# EAGLE board SwitchBoard (EAGLE 7.2.0), part 1 of 2
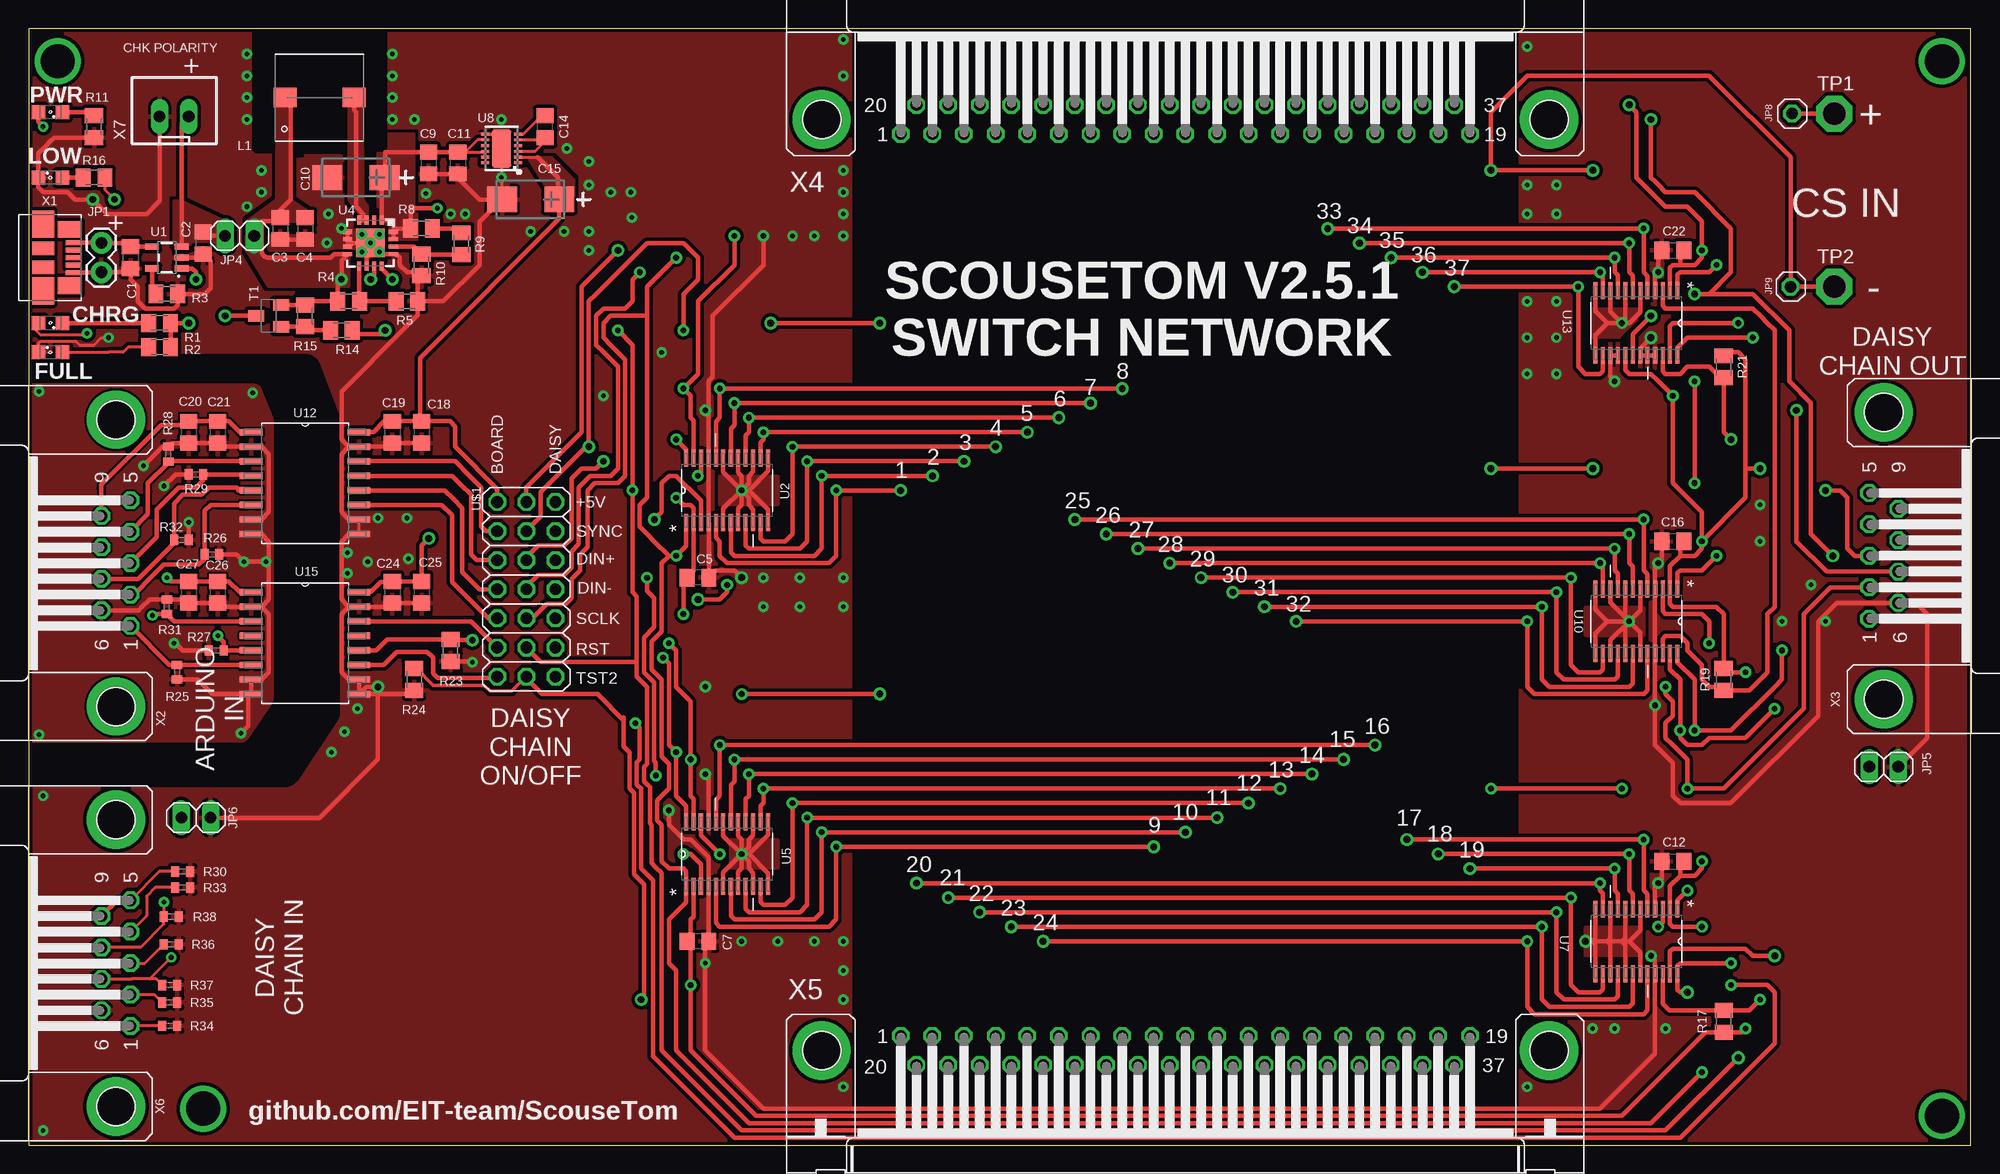
[diagram p6: board, top side]
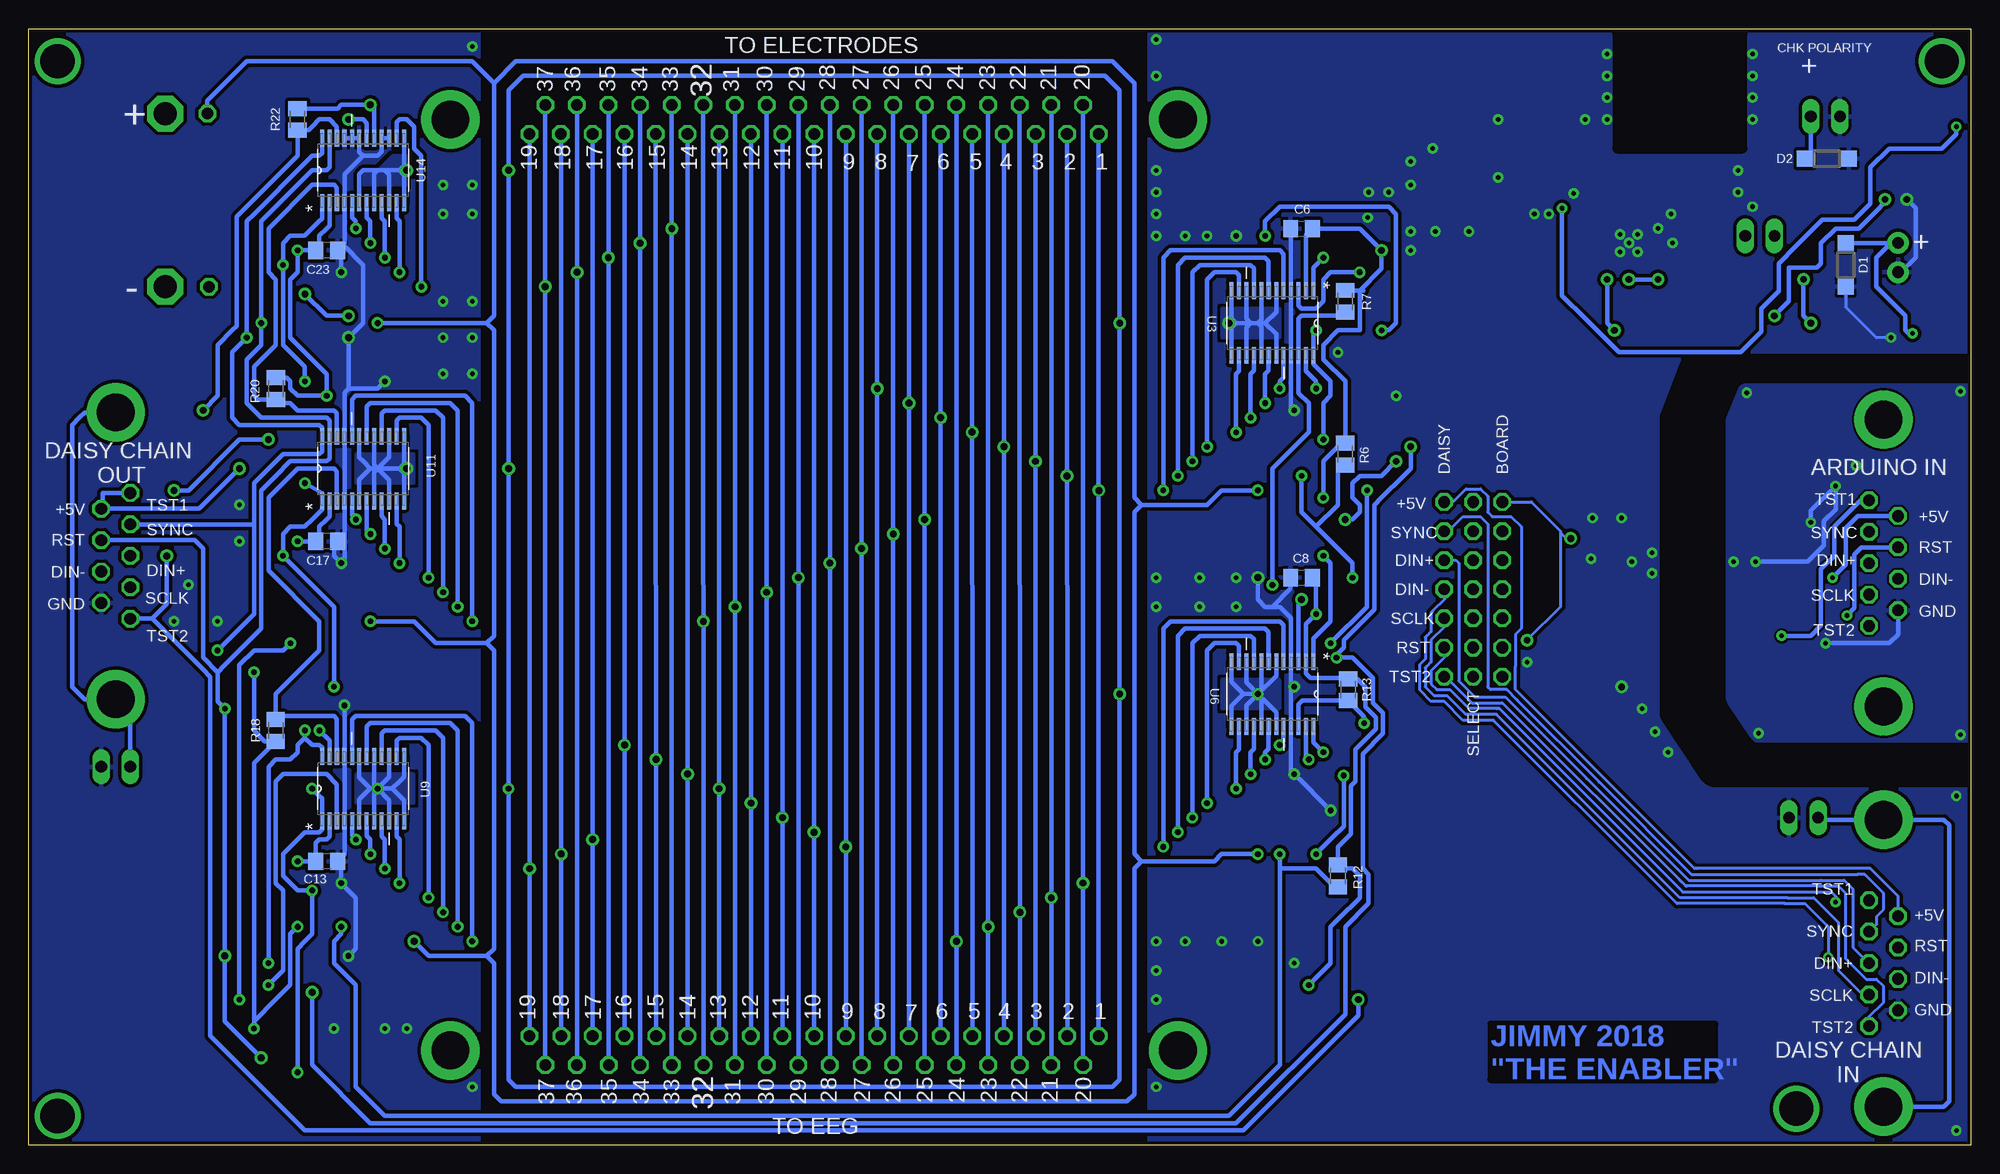
[diagram p7: board, bottom side, seen from below]

Size 169.53 x 97.46 mm. Coordinates in mm from the lower left corner, seen from the top.
Outline: 0,0 169.53,0 169.53,97.46 0,97.46 0,0
Copper layers (1*16): Top 0.035mm / dielectric 1.5mm / Bottom 0.035mm
Design rules "pcbtrain": minimum track width 0.2mm, minimum drill 0.4mm, track to track 0.2mm, track to pad 0.2mm, pad to pad 0.2mm, via to via 0.2mm, smd to smd 0mil, copper to edge 10mil, drill to drill 0.2mm, minimum pad ring 10mil, minimum via ring 10mil, stop-mask expansion 0.125mm, vias tented up to drill 0mil, thermal gap 10mil
tRestrict: area 19.9,86.6 to 30.9,97; area -5.1,31.8 to 26.7,68.6; area 72.4,-1.3 to 129.5,100.3
bRestrict: area 19.9,87 to 30.9,97; area -5.1,31.8 to 26.7,68.6; area 72.4,-1.3 to 129.5,100.3

## Footprints (pad centres in the part's own frame; a part is rotated, then mirrored left to right if it is on the bottom)
C0805 = smd 1.3 x 1.5: 1 -0.95,0; 2 0.95,0
CT6032 = smd 2.6 x 2.2: + -2.5,0; - 2.5,0
SOD123 = smd 1.4 x 1.4: A 1.9,0; C -1.9,0
1X02 = drill 1.016 pad 1.88: 1 0,0; 2 2.54,0
1X02' = drill 1.016 long: 1 -1.27,0; 2 1.27,0
1X01 = drill 1.016 octagon: 1 0,0
WE-PD_7332/7345_PLASTIC_BASE = smd 1.7 x 2: 1 0,3; 2 0,-3
SML0805 = smd 1.2 x 1.2: A 1.05,0; C -1.05,0
M0805 = smd 1.3 x 1.6: 1 -0.95,0; 2 0.95,0
R0402 = smd 0.7 x 0.9: 1 -0.65,0; 2 0.65,0
SOT23-BEC = smd 1 x 1.4: B -0.95,-1.1; C 0,1.1; E 0.95,-1.1
P1-20 = drill 2.007 pad 3.15 octagon: TP 0,0
SOT23-5 = smd 0.55 x 1.2: 1 -0.95,-1.3; 2 0,-1.3; 3 0.95,-1.3; 4 0.95,1.3; 5 -0.95,1.3
SOP65P640X120-24N = smd 1.473 x 0.356: 1 -2.819,3.581; 2 -2.819,2.921; 3 -2.819,2.286; 4 -2.819,1.626; 5 -2.819,0.965; 6 -2.819,0.33; 7 -2.819,-0.33; 8 -2.819,-0.965; 9 -2.819,-1.626; 10 -2.819,-2.286; 11 -2.819,-2.921; 12 -2.819,-3.581; 13 2.819,-3.581; 14 2.819,-2.921; 15 2.819,-2.286; 16 2.819,-1.626; 17 2.819,-0.965; 18 2.819,-0.33; 19 2.819,0.33; 20 2.819,0.965; 21 2.819,1.626; 22 2.819,2.286; 23 2.819,2.921; 24 2.819,3.581
QFN16-4X4 = smd 0.8 x 0.35: 1 -2,0.975; 2 -2,0.325; 3 -2,-0.325; 4 -2,-0.975; 9 2,-0.975; 10 2,-0.325; 11 2,0.325; 12 2,0.975 | smd 0.35 x 0.8: 5 -0.975,-2; 6 -0.325,-2; 7 0.325,-2; 8 0.975,-2; 13 0.975,2; 14 0.325,2; 15 -0.325,2; 16 -0.975,2 | smd 2.5 x 2.5: EXP 0,0
DFN12 = smd 0.25 x 0.7: 1 -1.25,-1.45; 2 -0.75,-1.45; 3 -0.25,-1.45; 4 0.25,-1.45; 5 0.75,-1.45; 6 1.25,-1.45; 7 1.25,1.45; 8 0.75,1.45; 9 0.25,1.45; 10 -0.25,1.45; 11 -0.75,1.45; 12 -1.25,1.45 | smd 3.3 x 1.7: EXP 0,0
SOIC127P1032X265-16N = smd 1.981 x 0.559: 1 -4.699,4.445; 2 -4.699,3.175; 3 -4.699,1.905; 4 -4.699,0.635; 5 -4.699,-0.635; 6 -4.699,-1.905; 7 -4.699,-3.175; 8 -4.699,-4.445; 9 4.699,-4.445; 10 4.699,-3.175; 11 4.699,-1.905; 12 4.699,-0.635; 13 4.699,0.635; 14 4.699,1.905; 15 4.699,3.175; 16 4.699,4.445
3X07 = drill 1.016 octagon: 1 -7.62,-3.81; 2 -7.62,1.27; 3 -5.08,-3.81; 4 -5.08,1.27; 5 -2.54,-3.81; 6 -2.54,1.27; 7 0,-3.81; 8 0,1.27; 9 2.54,-3.81; 10 2.54,1.27; 11 5.08,-3.81; 12 5.08,1.27; 13 7.62,-3.81; 14 7.62,1.27; 15 -7.62,-1.27; 16 -5.08,-1.27; 17 -2.54,-1.27; 18 0,-1.27; 19 2.54,-1.27; 20 5.08,-1.27; 21 7.62,-1.27
MOLEX_47346-0001 = smd 0.45 x 1.38: 1 -1.3,0; 2 -0.65,0; 3 0,0; 4 0.65,0; 5 1.3,0 | smd 1.475 x 2.1: M1 -2.462,-0.36; M2 2.462,-0.36 | smd 2.375 x 1.9: M3 -2.913,-2.66; M6 2.913,-2.66 | smd 1.175 x 1.9: M4 -0.82,-2.66; M5 0.85,-2.66
F09HP = drill 1.016 octagon: 1 -5.486,-1.27; 2 -2.743,-1.27; 3 0,-1.27; 4 2.743,-1.27; 5 5.486,-1.27; 6 -4.115,1.27; 7 -1.372,1.27; 8 1.372,1.27; 9 4.115,1.27 | drill 3.302 pad 5.08: G1 -12.522,0; G2 12.522,0
M09HP = drill 1.016 octagon: 1 -5.486,1.27; 2 -2.743,1.27; 3 0,1.27; 4 2.743,1.27; 5 5.486,1.27; 6 -4.115,-1.27; 7 -1.372,-1.27; 8 1.372,-1.27; 9 4.115,-1.27 | drill 3.302 pad 5.08: G1 -12.522,0; G2 12.522,0
F37HP = drill 1.016 octagon: 1 -24.841,-1.27; 2 -22.073,-1.27; 3 -19.329,-1.27; 4 -16.561,-1.27; 5 -13.792,-1.27; 6 -11.049,-1.27; 7 -8.28,-1.27; 8 -5.512,-1.27; 9 -2.769,-1.27; 10 0,-1.27; 11 2.769,-1.27; 12 5.512,-1.27; 13 8.28,-1.27; 14 11.049,-1.27; 15 13.818,-1.27; 16 16.561,-1.27; 17 19.329,-1.27; 18 22.098,-1.27; 19 24.841,-1.27; 20 -23.47,1.27; 21 -20.701,1.27; 22 -17.932,1.27; 23 -15.189,1.27; 24 -12.421,1.27; 25 -9.652,1.27; 26 -6.909,1.27; 27 -4.14,1.27; 28 -1.372,1.27; 29 1.372,1.27; 30 4.14,1.27; 31 6.909,1.27; 32 9.677,1.27; 33 12.421,1.27; 34 15.189,1.27; 35 17.958,1.27; 36 20.701,1.27; 37 23.47,1.27 | drill 3.302 pad 5.08: G1 -31.75,0; G2 31.75,0
M37HP = drill 1.016 octagon: 1 -24.841,1.27; 2 -22.098,1.27; 3 -19.329,1.27; 4 -16.561,1.27; 5 -13.818,1.27; 6 -11.049,1.27; 7 -8.28,1.27; 8 -5.512,1.27; 9 -2.769,1.27; 10 0,1.27; 11 2.769,1.27; 12 5.512,1.27; 13 8.28,1.27; 14 11.049,1.27; 15 13.792,1.27; 16 16.561,1.27; 17 19.329,1.27; 18 22.073,1.27; 19 24.841,1.27; 20 -23.47,-1.27; 21 -20.701,-1.27; 22 -17.958,-1.27; 23 -15.189,-1.27; 24 -12.421,-1.27; 25 -9.652,-1.27; 26 -6.909,-1.27; 27 -4.14,-1.27; 28 -1.372,-1.27; 29 1.372,-1.27; 30 4.14,-1.27; 31 6.909,-1.27; 32 9.652,-1.27; 33 12.421,-1.27; 34 15.189,-1.27; 35 17.932,-1.27; 36 20.701,-1.27; 37 23.47,-1.27 | drill 3.302 pad 5.08: G1 -31.75,0; G2 31.75,0
JST-XH-02-PACKAGE-LONG-PAD = drill 1.016 long: 1 -1.27,0; 2 1.27,0

## Placement (x,y rotation side)
C1  10uF  [C0805]  8.89,77.47 270 top
C2  10uF  [C0805]  15.24,78.74 270 top
C3  10uF  [C0805]  21.97,80.01 270 top
C4  0.1uF  [C0805]  24.13,80.01 270 top
C5  0.1uF  [C0805]  58.42,49.53 180 top
C6  0.1uF  [C0805]  58.42,80.01 0 bottom
C7  0.1uF  [C0805]  58.42,17.78 180 top
C8  0.1uF  [C0805]  58.42,49.53 0 bottom
C9  2.2uF  [C0805]  34.92,85.72 270 top
C10  100uF  [CT6032]  28.57,84.46 180 top
C11  10uF  [C0805]  37.47,85.72 270 top
C12  0.1uF  [C0805]  143.51,24.76 0 top
C13  0.1uF  [C0805]  143.51,24.77 180 bottom
C14  0.01uF  [C0805]  45.09,88.9 90 top
C15  100uF  [CT6032]  43.81,82.55 180 top
C16  0.1uF  [C0805]  143.51,52.7 0 top
C17  0.1uF  [C0805]  143.51,52.71 180 bottom
C18  .1uF  [C0805]  34.29,62.23 270 top
C19  1uF  [C0805]  31.75,62.23 270 top
C20  .1uF  [C0805]  13.97,62.23 270 top
C21  1uF  [C0805]  16.51,62.23 270 top
C22  0.1uF  [C0805]  143.51,78.1 0 top
C23  0.1uF  [C0805]  143.51,78.11 180 bottom
C24  .1uF  [C0805]  31.75,48.26 270 top
C25  1uF  [C0805]  34.29,48.26 270 top
C26  .1uF  [C0805]  16.51,48.26 270 top
C27  1uF  [C0805]  13.97,48.26 270 top
D1  1N4148W-7-F  [SOD123]  10.92,76.84 270 bottom
D2  1N4148W-7-F  [SOD123]  12.57,86.11 0 bottom
JP1  IN  [1X02]  6.35,78.74 270 top
JP4  PWR  [1X02']  18.41,79.38 0 top
JP5  Shld  [1X02']  161.93,33.02 180 top
JP6  Shld  [1X02']  14.61,28.57 0 top
JP8  CS_IN+  [1X01]  153.92,90.04 0 top
JP9  CS_IN-  [1X01]  153.8,74.93 0 top
L1  6.8uH  [WE-PD_7332/7345_PLASTIC_BASE]  25.4,91.44 90 top
LED1  YELLOW  [SML0805]  1.9,71.75 180 top
LED2  GREEN  [SML0805]  1.9,69.22 0 top
LED3  GREEN  [SML0805]  1.9,90.17 180 top
LED4  RED  [SML0805]  1.9,84.46 0 top
R1  470  [M0805]  11.43,71.75 180 top
R2  1k  [M0805]  11.43,69.66 180 top
R3  2k  [M0805]  12.06,74.29 180 top
R4  2M  [M0805]  27.94,73.66 180 top
R5  360k  [M0805]  33.02,73.66 180 top
R6  10k  [M0805]  54.61,60.33 90 bottom
R7  10k  [M0805]  54.61,73.66 90 bottom
R8  1.8M  [M0805]  34.29,80.01 180 top
R9  82k  [M0805]  37.78,78.68 90 top
R10  200k  [M0805]  34.29,76.84 90 top
R11  1k  [M0805]  5.71,88.9 270 top
R12  10k  [M0805]  55.25,23.5 90 bottom
R13  10k  [M0805]  54.36,39.75 90 bottom
R14  4.7k  [M0805]  27.3,71.12 180 top
R15  47k  [M0805]  24.13,72.39 90 top
R16  1k  [M0805]  5.71,84.46 180 top
R17  10k  [M0805]  147.96,10.8 270 top
R18  10k  [M0805]  147.96,36.2 270 bottom
R19  10k  [M0805]  147.95,40.64 90 top
R20  10k  [M0805]  147.95,66.04 90 bottom
R21  10k  [M0805]  147.96,67.94 90 top
R22  10k  [M0805]  146.05,89.53 90 bottom
R23  10M  [M0805]  36.83,43.18 90 top
R24  10M  [M0805]  33.66,40.64 90 top
R25  10k  [R0402]  12.95,41.27 270 top
R26  10k  [R0402]  16,51.56 0 top
R27  10k  [R0402]  16.38,43.18 0 top
R28  10k  [R0402]  12.19,60.32 270 top
R29  10k  [R0402]  14.61,58.55 0 top
R30  10k  [R0402]  13.46,23.88 180 top
R31  10k  [R0402]  12.06,46.99 270 top
R32  10k  [R0402]  13.33,52.83 180 top
R33  10k  [R0402]  13.46,22.48 180 top
R34  10k  [R0402]  12.32,10.41 180 top
R35  10k  [R0402]  12.32,12.45 180 top
R36  10k  [R0402]  12.45,17.53 180 top
R37  10k  [R0402]  12.32,13.97 180 top
R38  10k  [R0402]  12.45,19.94 180 top
T1  PNP  [SOT23-BEC]  20.95,72.39 90 top
TP1  TPPAD1-20  [P1-20]  157.61,90.04 0 top
TP2  TPPAD1-20  [P1-20]  157.61,74.93 0 top
U1  MCP73831  [SOT23-5]  12.06,77.47 90 top
U2  ADG714BRUZ  [SOP65P640X120-24N]  60.96,57.15 90 top
U3  ADG714BRUZ  [SOP65P640X120-24N]  60.96,71.76 270 bottom
U4  TPS61090RSAR  [QFN16-4X4]  29.84,78.74 270 top
U5  ADG714BRUZ  [SOP65P640X120-24N]  60.96,25.4 90 top
U6  ADG714BRUZ  [SOP65P640X120-24N]  60.96,39.37 270 bottom
U7  ADG714BRUZ  [SOP65P640X120-24N]  140.34,17.78 270 top
U8  LT1763CDE-5  [DFN12]  41.27,87 90 top
U9  ADG714BRUZ  [SOP65P640X120-24N]  140.33,31.12 90 bottom
U10  ADG714BRUZ  [SOP65P640X120-24N]  140.34,45.72 270 top
U11  ADG714BRUZ  [SOP65P640X120-24N]  140.33,59.06 90 bottom
U12  ADUM1410ARWZ  [SOIC127P1032X265-16N]  24.13,57.78 0 top
U13  ADG714BRUZ  [SOP65P640X120-24N]  140.34,71.75 270 top
U14  ADG714BRUZ  [SOP65P640X120-24N]  140.33,85.09 90 bottom
U15  ADUM1412ARWZ  [SOIC127P1032X265-16N]  24.13,43.81 0 top
U$1  PINHD-3X7GAP  [3X07]  44.7,48.51 270 top
X1  [MOLEX_47346-0001]  3.94,77.47 270 top
X2  CTR_ARD  [F09HP]  7.62,50.8 90 top
X3  CTR_OUT  [M09HP]  161.93,51.44 90 top
X4  DSUB _T  [F37HP]  100.96,89.54 0 top
X5  DSUB_B  [M37HP]  100.96,8.25 0 top
X6  CTR_IN  [F09HP]  7.62,15.88 90 top
X7  JST-XH-02-PIN-LONG-PAD  [JST-XH-02-PACKAGE-LONG-PAD]  12.7,89.79 0 top